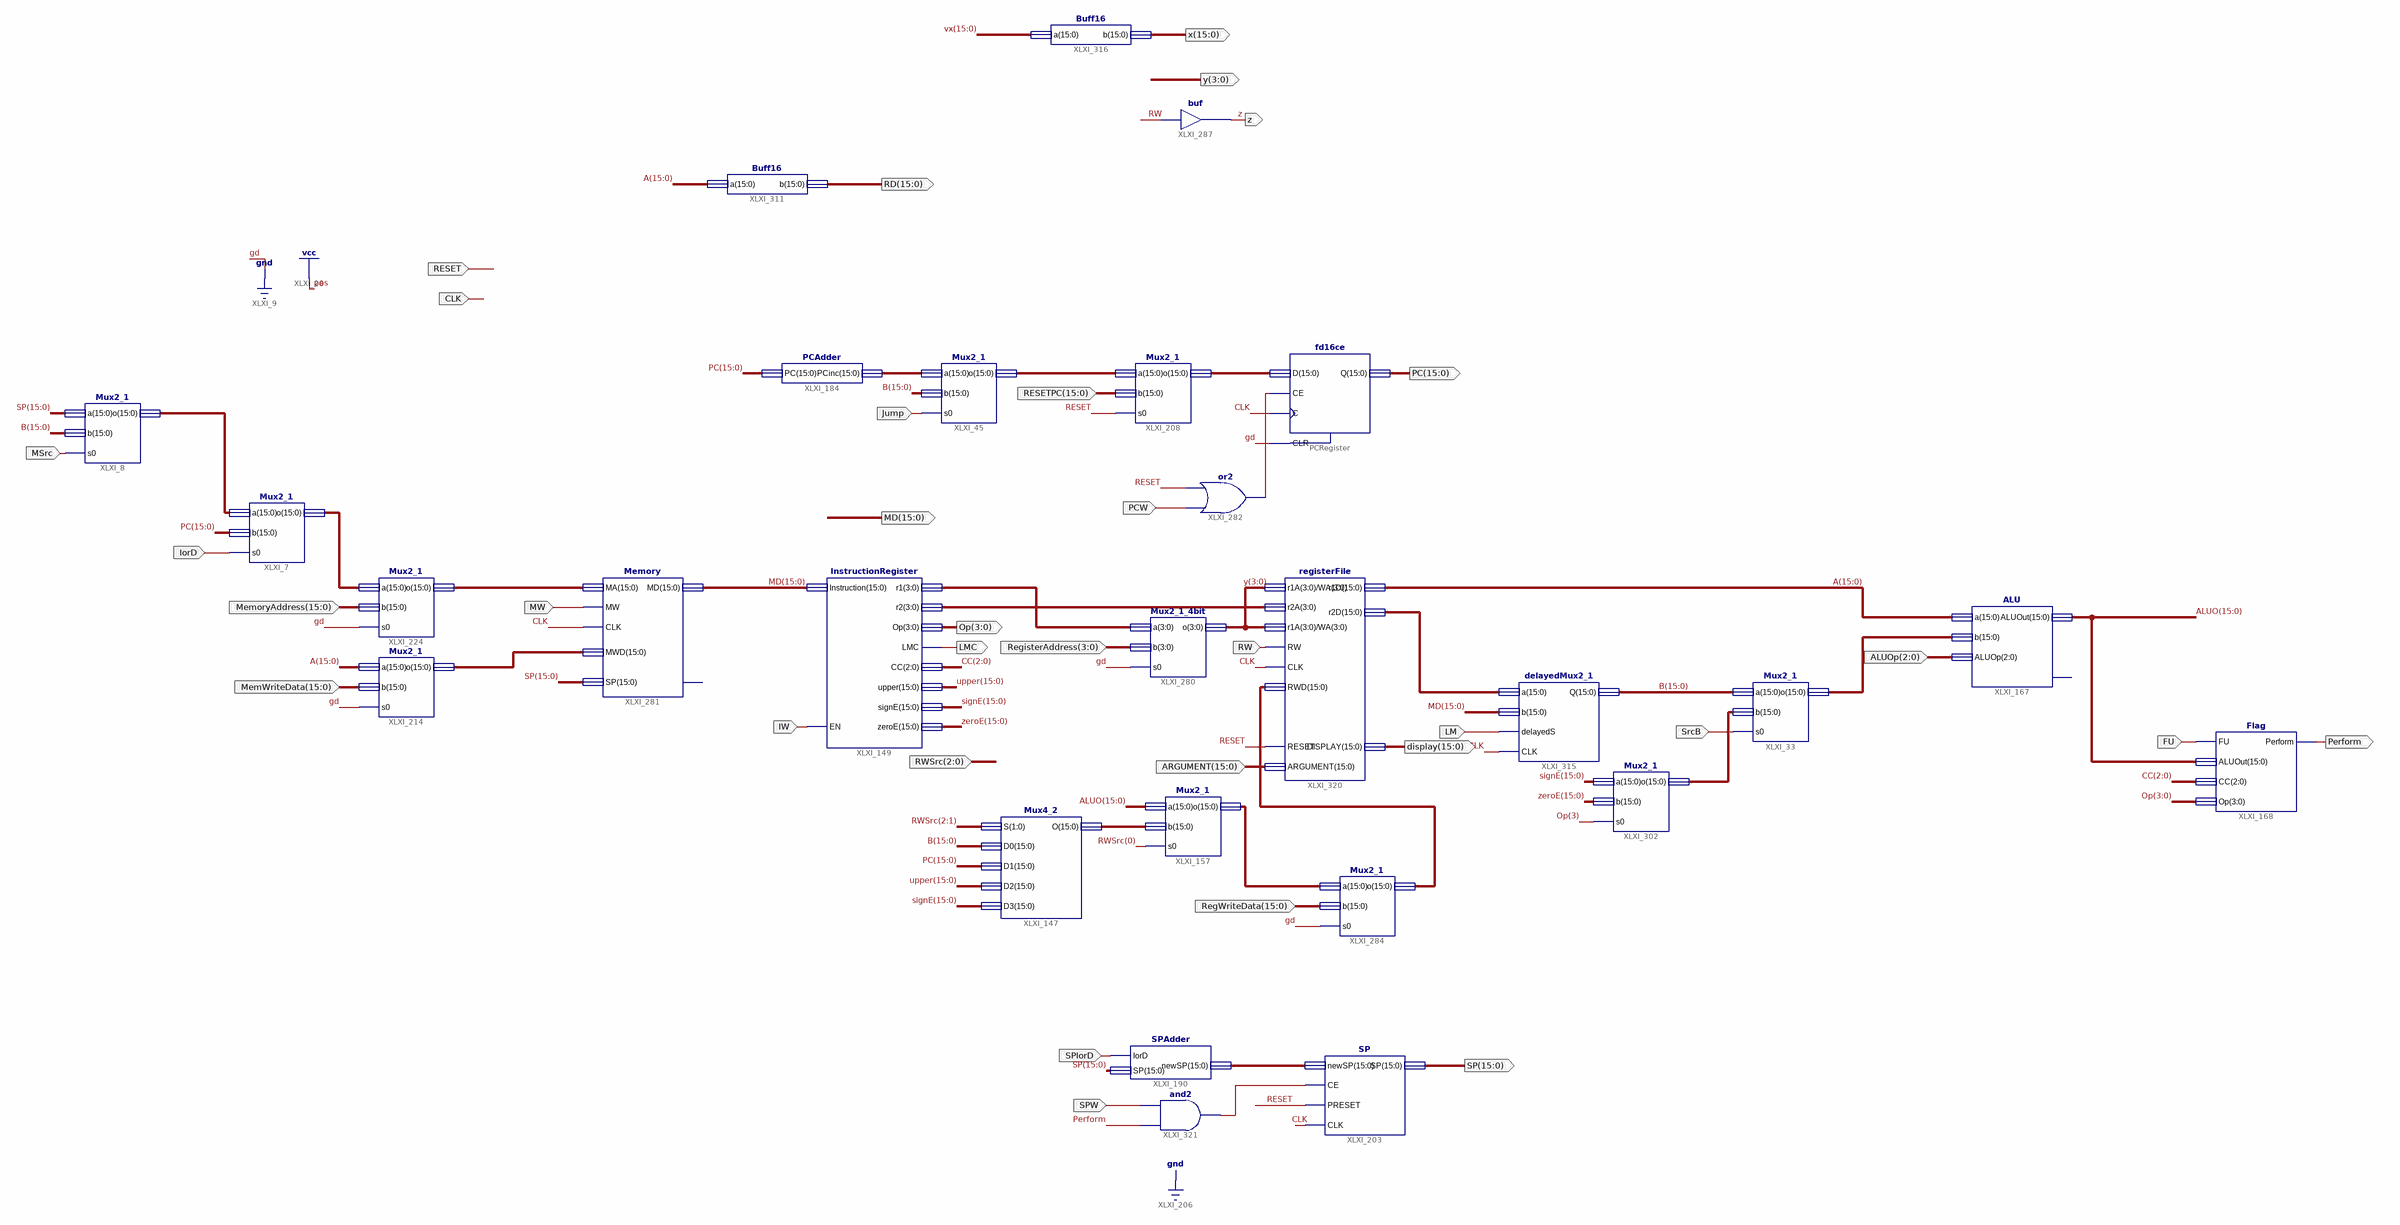
[diagram p0: schematic sheet 1]
// Xilinx ISE schematic DatapathTest.sch (spartan3e) as structural Verilog: 27 symbols, 34 ports
module DatapathTest (
  input  CLK,
  input  [2:0] ALUOp,
  input  SrcB,
  input  FU,
  input  RW,
  input  SPIorD,
  input  RESET,
  input  MSrc,
  input  [15:0] MemWriteData,
  input  IorD,
  input  [15:0] MemoryAddress,
  input  MW,
  input  [2:0] RWSrc,
  input  PCW,
  input  Jump,
  input  [15:0] RESETPC,
  input  [3:0] RegisterAddress,
  input  LM,
  input  IW,
  input  [15:0] RegWriteData,
  input  [15:0] ARGUMENT,
  input  SPW,
  output [15:0] MD,
  output Perform,
  output [3:0] Op,
  output [15:0] PC,
  output [15:0] SP,
  output LMC,
  output [15:0] vx,
  output [3:0] y,
  output [15:0] RD,
  output z,
  output [15:0] x,
  output [15:0] display
);

  wire XLXN_760, XLXN_944;
  wire [2:0] CC;
  wire [3:0] XLXN_752, XLXN_806;
  wire [15:0] A, afeavarwgfa, ALUO, B, EFEFA, signE, upper, xaefvawreg, XLXN_11, XLXN_37, XLXN_43, XLXN_179,
       XLXN_748, XLXN_749, XLXN_781, XLXN_782, XLXN_922, XLXN_933, zeroE;

  ALU XLXI_167 (.a(A), .b(XLXN_933), .ALUOp(ALUOp), .ALUOut(ALUO));  // open: Overflow
  Flag XLXI_168 (.FU(FU), .ALUOut(ALUO), .CC(CC), .Op(Op), .Perform(Perform));
  Mux2_1 XLXI_157 (.a(ALUO), .b(xaefvawreg), .s0(RWSrc[0]), .o(afeavarwgfa));
  Mux4_2 XLXI_147 (.S(RWSrc[2:1]), .D0(B), .D3(signE), .O(xaefvawreg), .D1(PC), .D2(upper));
  Mux2_1 XLXI_33 (.a(B), .b(XLXN_922), .s0(SrcB), .o(XLXN_933));
  SP XLXI_203 (.SP(SP), .CE(XLXN_944), .PRESET(RESET), .CLK(CLK), .newSP(XLXN_43));
  SPAdder XLXI_190 (.IorD(SPIorD), .SP(SP), .newSP(XLXN_43));
  Mux2_1 XLXI_8 (
    .a(SP), .b(B), .s0(MSrc),
    .o({XLXN_11[0], XLXN_11[1], XLXN_11[2], XLXN_11[3], XLXN_11[4], XLXN_11[5], XLXN_11[6], XLXN_11[7], XLXN_11[8], XLXN_11[9], XLXN_11[10], XLXN_11[11], XLXN_11[12], XLXN_11[13], XLXN_11[14], XLXN_11[15]}));
  Mux2_1 XLXI_7 (
    .a({XLXN_11[0], XLXN_11[1], XLXN_11[2], XLXN_11[3], XLXN_11[4], XLXN_11[5], XLXN_11[6], XLXN_11[7], XLXN_11[8], XLXN_11[9], XLXN_11[10], XLXN_11[11], XLXN_11[12], XLXN_11[13], XLXN_11[14], XLXN_11[15]}),
    .b(PC), .s0(IorD), .o(XLXN_749));
  Mux2_1 XLXI_214 (.a(A), .b(MemWriteData), .s0(1'b0), .o(XLXN_37));
  Mux2_1 XLXI_224 (.a(XLXN_749), .b(MemoryAddress), .s0(1'b0), .o(XLXN_748));
  InstructionRegister XLXI_149 (
    .Instruction(MD), .LMC(LMC), .r1(XLXN_806), .r2(XLXN_752), .Op(Op), .CC(CC), .signE(signE),
    .upper(upper), .EN(IW), .zeroE(zeroE));
  fd16ce PCRegister (.C(CLK), .CE(XLXN_760), .CLR(1'b0), .D(XLXN_782), .Q(PC));
  PCAdder XLXI_184 (.PC(PC), .PCinc(XLXN_179));
  or XLXI_282 (XLXN_760, PCW, RESET);
  Mux2_1 XLXI_45 (.a(XLXN_179), .b(B), .s0(Jump), .o(XLXN_781));
  Mux2_1 XLXI_208 (.a(XLXN_781), .b(RESETPC), .s0(RESET), .o(XLXN_782));
  Mux2_1_4bit XLXI_280 (.a(XLXN_806), .b(RegisterAddress), .s0(1'b0), .o(y));
  Mux2_1 XLXI_302 (.a(signE), .b(zeroE), .s0(Op[3]), .o(XLXN_922));
  delayedMux2_1 XLXI_315 (.Q(B), .delayedS(LM), .CLK(CLK), .a(EFEFA), .b(MD));
  Buff16 XLXI_311 (.a(A), .b(RD));
  buf XLXI_287 (z, RW);
  Buff16 XLXI_316 (.a(vx), .b(x));
  Mux2_1 XLXI_284 (.a(afeavarwgfa), .b(RegWriteData), .s0(1'b0), .o(vx));
  registerFile XLXI_320 (
    .RW(RW), .CLK(CLK), .r1A(y), .r2A(XLXN_752), .WA(y), .RWD(vx), .ARGUMENT(ARGUMENT), .r1D(A), .r2D(EFEFA),
    .DISPLAY(display), .RESET(RESET));
  Memory XLXI_281 (.MA(XLXN_748), .MW(MW), .MD(MD), .CLK(CLK), .MWD(XLXN_37), .SP(SP));  // open: segFault
  and XLXI_321 (XLXN_944, Perform, SPW);
endmodule
